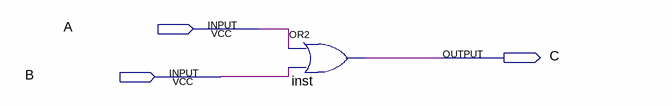
[diagram p0: schematic sheet]
// Quartus schematic lab3_1.bdf as structural Verilog: 1 symbols, 3 pins
module lab3_1 (
  input  A,
  input  B,
  output C
);

  or inst (C, A, B);
endmodule
